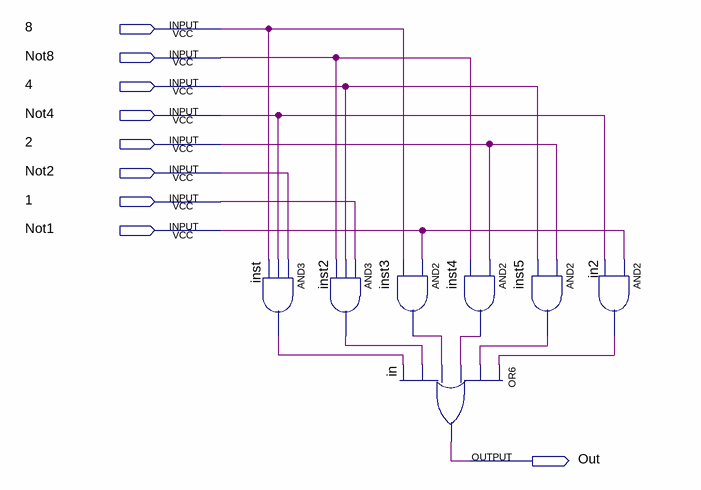
[diagram p0: schematic sheet]
// Quartus schematic A.bdf as structural Verilog: 7 symbols, 9 pins
module A (
  input  \8 ,
  input  Not8,
  input  \4 ,
  input  Not4,
  input  \2 ,
  input  Not2,
  input  \1 ,
  input  Not1,
  output Out
);

  wire in2_out, inst2_out, inst3_out, inst4_out, inst5_out, inst_out;

  and inst (inst_out, Not2, Not4, \8 );
  and inst2 (inst2_out, \1 , \4 , Not8);
  and inst3 (inst3_out, Not1, \8 );
  or in (Out, in2_out, inst5_out, inst4_out, inst3_out, inst2_out, inst_out);
  and inst4 (inst4_out, \2 , Not8);
  and inst5 (inst5_out, \2 , \4 );
  and in2 (in2_out, Not1, Not4);
endmodule
